# Altium project PowerModule.PrjPcb
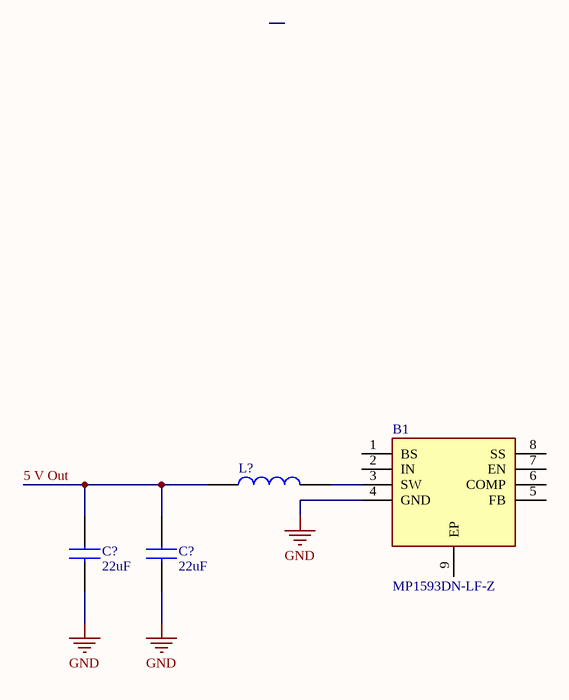
[diagram p0: PowerModule.SchDoc]
1 sheet, 4 parts. Net scope: global (net labels, ports and power ports of the same name join across sheets).

## Sheet PowerModule.SchDoc
size A4; SheetNumber: 1; SheetTotal: 1

### Parts
(Parts that share a designator on the sheet are numbered #1, #2 ... from top to bottom, then left to right.)
B1  MP1593DN-LF-Z  [SOIC127P600X170-9N]
C?#1  22uF  [Capacitor  X7R 22uF]
C?#2  22uF  [Capacitor  X7R 22uF]
L?  150 uH  [Inductor 150]  (value not drawn)

### Nets
GND: B1.4(GND) C?#1.1 C?#2.1
5 V Out: C?#1.2 C?#2.2 L?.1
NetB1_3: B1.3(SW) L?.2

Not connected (* = marked no-connect by the designer): B1 1(BS) 2(IN) 5(FB) 6(COMP) 7(EN) 8(SS) 9(EP)

### Library data of the parts
B1 = MP1593DN-LF-Z: Buck Switching Regulator IC Positive Adjustable 1.22V 1 Output 3A 8-SOIC (0.154", 3.90mm Width) Exposed Pad; Manufacturer_Name: Monolithic Power Systems (MPS); Geometry.Height: 1.7mm; Mouser Part Number: 946-MP1593DNLFZ; Mouser Price/Stock: https://www.mouser.co.uk/ProductDetail/Monolithic-Power-Systems-MPS/MP1593DN-LF-Z?qs=rC7bBWoQAAliNryLBLWSWg%3D%3D; Manufacturer_Part_Number: MP1593DN-LF-Z; Datasheet Link: http://www.monolithicpower.com/DesktopModules/DocumentManage/API/Document/getDocument?id=248
C?#1 C?#2 = Capacitor X7R 25V 22uF: Multilayer Ceramic Chip Capacitors, Capacitance=22uF, LxWxT:3.2x2.5x2.5mm; Manufacturer_Name: TDK; Manufacturer_Part_Number: CGA6P3X7R1E226M250AB; Geometry.Height: 2.8mm; Mouser Part Number: 810-CGA6P3X7R1E226M2; Mouser Price/Stock: https://www.mouser.co.uk/ProductDetail/TDK/CGA6P3X7R1E226M250AB?qs=w%2Fv1CP2dgqrKXzeuDypldA%3D%3D; Datasheet Link: https://product.tdk.com/system/files/dam/doc/product/capacitor/ceramic/mlcc/catalog/mlcc_automotive_general_en.pdf
L? = Inductor 150: 15 H Shielded Molded Inductor 3 A 120mOhm Max Nonstandard; Manufacturer_Name: ABRACON; Manufacturer_Part_Number: ASPI-0630LR-150M-T15; Geometry.Height: 3mm; Mouser Part Number: 815-ASPI0630LR150T15; Mouser Price/Stock: https://www.mouser.co.uk/ProductDetail/ABRACON/ASPI-0630LR-150M-T15?qs=bWAYEm3xoCYKmwZKzI2%2F7Q%3D%3D; Datasheet Link: https://abracon.com/Magnetics/power/ASPI-0630LR.pdf